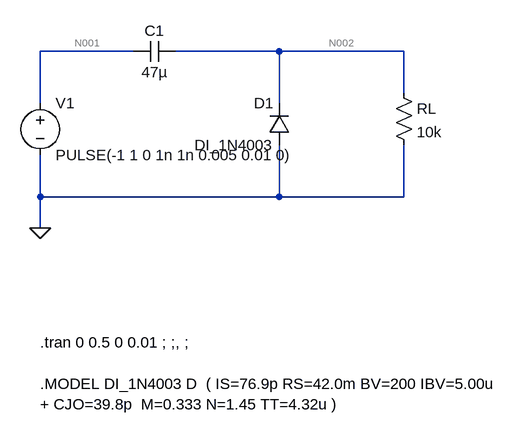
[diagram p0: schematic B1c.asc]
B1c.asc, the LTspice schematic file:
Version 4.1
SHEET 1 880 680
WIRE 144 48 0 48
WIRE 368 48 208 48
WIRE 560 48 368 48
WIRE 560 112 560 48
WIRE 0 128 0 48
WIRE 368 128 368 48
WIRE 0 272 0 208
WIRE 368 272 368 192
WIRE 368 272 0 272
WIRE 560 272 560 192
WIRE 560 272 368 272
WIRE 0 320 0 272
FLAG 0 320 0
SYMBOL voltage 0 112 R0
WINDOW 123 0 0 Left 0
WINDOW 39 0 0 Left 0
SYMATTR InstName V1
SYMATTR Value PULSE(-1 1 0 1n 1n 0.005 0.01 0)
SYMBOL cap 208 32 R90
WINDOW 0 0 32 VBottom 2
WINDOW 3 32 32 VTop 2
SYMATTR InstName C1
SYMATTR Value 47µ
SYMBOL diode 384 192 R180
WINDOW 0 24 64 Left 2
WINDOW 3 24 0 Left 2
SYMATTR InstName D1
SYMATTR Value DI_1N4003
SYMBOL res 544 96 R0
SYMATTR InstName RL
SYMATTR Value 10k
TEXT 0 496 Left 2 !.tran 0 0.5 0 0.01 ; ;, ;
TEXT 0 560 Left 2 !.MODEL DI_1N4003 D  ( IS=76.9p RS=42.0m BV=200 IBV=5.00u\n+ CJO=39.8p  M=0.333 N=1.45 TT=4.32u )

The netlist it stands for:
* B1c.asc
V1 N001 0 PULSE(-1 1 0 1n 1n 0.005 0.01 0)
C1 N002 N001 47µ
D1 0 N002 DI_1N4003
RL N002 0 10k
.model D D
.lib standard.dio
.tran 0 0.5 0 0.01 ; ;, ;
.MODEL DI_1N4003 D  ( IS=76.9p RS=42.0m BV=200 IBV=5.00u
+ CJO=39.8p  M=0.333 N=1.45 TT=4.32u )
.backanno
.end

* Results of the author's LTspice run, read from the files saved beside the schematic
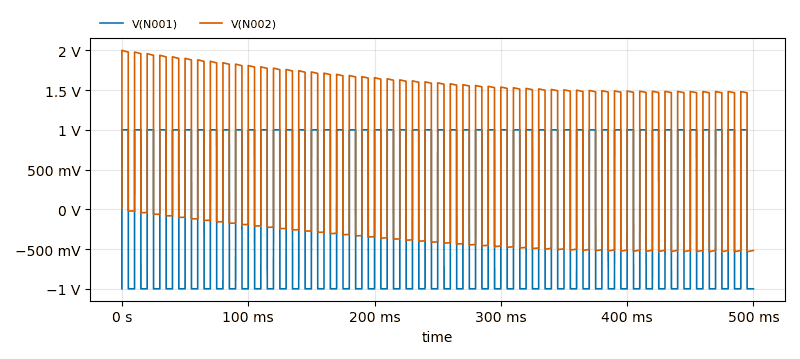
[diagram p1: Transient Analysis of B1c.asc, plotted from the saved traces]
* Transient Analysis, 1 run:
*   V(N001): min -1 V, max 1 V, average 198.8 nV, rms 1 V, last -1 V
*   V(N002): min -533.4 mV, max 2 V, average 636.8 mV, rms 1.198 V, last -517.8 mV